# Altium schematic sheet ControlPWMSin.SchDoc
size A4
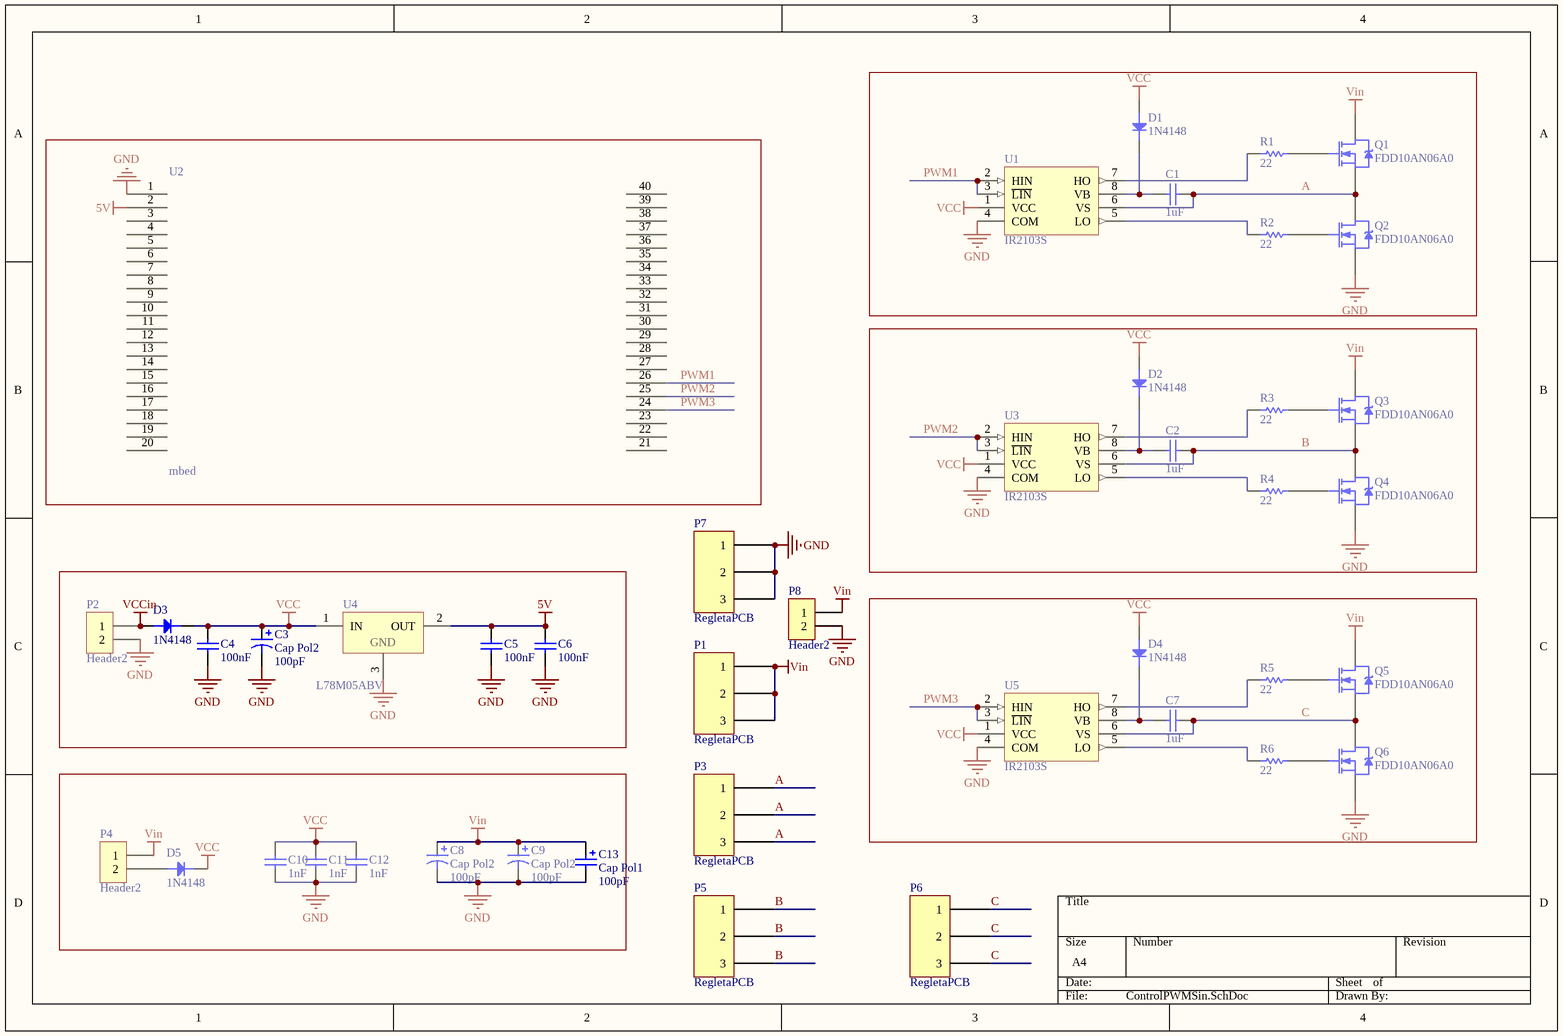
[diagram p0: ControlPWMSin.SchDoc]

## Parts
C1  value 1uF  [0805_CAP]  (hidden comment: Capacitor)
C2  value 1uF  [0805_CAP]  (hidden comment: Capacitor)
C3  Cap Pol2  value 100pF  [TC7360-2924]
C4  value 100nF  [0805_CAP]  (hidden comment: Capacitor)
C5  value 100nF  [0805_CAP]  (hidden comment: Capacitor)
C6  value 100nF  [0805_CAP]  (hidden comment: Capacitor)
C7  value 1uF  [0805_CAP]  (hidden comment: Capacitor)
C8  Cap Pol2  value 100pF  [TC7360-2924]
C9  Cap Pol2  value 100pF  [TC7360-2924]
C10  value 1nF  [0805_CAP]  (hidden comment: Capacitor)
C11  value 1nF  [0805_CAP]  (hidden comment: Capacitor)
C12  value 1nF  [0805_CAP]  (hidden comment: Capacitor)
C13  Cap Pol1  value 100pF  [RB7.6-15]
D1  1N4148  [1N4148SMD]
D2  1N4148  [1N4148SMD]
D3  1N4148  [1N4148SMD]
D4  1N4148  [1N4148SMD]
D5  1N4148  [1N4148SMD]
P1  RegletaPCB  [RegletaPCBx3]
P2  Header2  [Header2Macho]
P3  RegletaPCB  [RegletaPCBx3]
P4  Header2  [Header2Macho]
P5  RegletaPCB  [RegletaPCBx3]
P6  RegletaPCB  [RegletaPCBx3]
P7  RegletaPCB  [RegletaPCBx3]
P8  Header2  [Header2Macho]
Q1  FDD10AN06A0  [TO252-3N]
Q2  FDD10AN06A0  [TO252-3N]
Q3  FDD10AN06A0  [TO252-3N]
Q4  FDD10AN06A0  [TO252-3N]
Q5  FDD10AN06A0  [TO252-3N]
Q6  FDD10AN06A0  [TO252-3N]
R1  value 22  [0805_RES]  (hidden comment: Resistor)
R2  value 22  [0805_RES]  (hidden comment: Resistor)
R3  value 22  [0805_RES]  (hidden comment: Resistor)
R4  value 22  [0805_RES]  (hidden comment: Resistor)
R5  value 22  [0805_RES]  (hidden comment: Resistor)
R6  value 22  [0805_RES]  (hidden comment: Resistor)
U1  IR2103S  [SOIC127P600-8BN]
U2  mbed  [mbed]
U3  IR2103S  [SOIC127P600-8BN]
U4  L78M05ABV  [TO220V]
U5  IR2103S  [SOIC127P600-8BN]

## Nets
5V: C5.1 C6.1 U2.2 U4.2(OUT)
GND: C3.2 C4.2 C5.2 C6.2 C8.2 C9.2 C10.1 C11.1 C12.1 C13.2 P2.2 P7.1 P7.2 P7.3 P8.2 Q2.3(S) Q4.3(S) Q6.3(S) U1.4(COM) U2.1 U3.4(COM) U4.3(GND) U5.4(COM)
VCC: C3.1 C4.1 C10.2 C11.2 C12.2 D1.1(A) D2.1(A) D3.2(K) D4.1(A) D5.2(K) U1.1(VCC) U3.1(VCC) U4.1(IN) U5.1(VCC)
VCCin: D3.1(A) P2.1
Vin: C8.1 C9.1 C13.1 P1.1 P1.2 P1.3 P4.1 P8.1 Q1.4(D) Q3.4(D) Q5.4(D)
A: C1.1 P3.1 P3.2 P3.3 Q1.3(S) Q2.4(D) U1.6(VS)
B: C2.1 P5.1 P5.2 P5.3 Q3.3(S) Q4.4(D) U3.6(VS)
C: C7.1 P6.1 P6.2 P6.3 Q5.3(S) Q6.4(D) U5.6(VS)
PWM1: U1.2(HIN) U1.3(~{LIN}) U2.26
PWM2: U2.25 U3.2(HIN) U3.3(~{LIN})
PWM3: U2.24 U5.2(HIN) U5.3(~{LIN})
NetC1_2: C1.2 D1.2(K) U1.8(VB)
NetC2_2: C2.2 D2.2(K) U3.8(VB)
NetC7_2: C7.2 D4.2(K) U5.8(VB)
NetD5_1: D5.1(A) P4.2
NetQ1_1: Q1.1(G) R1.2
NetQ2_1: Q2.1(G) R2.2
NetQ3_1: Q3.1(G) R3.2
NetQ4_1: Q4.1(G) R4.2
NetQ5_1: Q5.1(G) R5.2
NetQ6_1: Q6.1(G) R6.2
NetR1_1: R1.1 U1.7(HO)
NetR2_1: R2.1 U1.5(LO)
NetR3_1: R3.1 U3.7(HO)
NetR4_1: R4.1 U3.5(LO)
NetR5_1: R5.1 U5.7(HO)
NetR6_1: R6.1 U5.5(LO)

Not connected (* = marked no-connect by the designer): U2 3 4 5 6 7 8 9 10 11 12 13 14 15 16 17 18 19 20 21 22 23 27 28 29 30 31 32 33 34 35 36 37 38 39 40

## Library data of the parts
C1 C2 C4-C7 C10-C12 = Cap
C3 C8 C9 = Cap Pol2: Polarized Capacitor (Axial); Published: 8-Jun-2000; LatestRevisionDate: 17-Jul-2002; LatestRevisionNote: Re-released for DXP Platform.; PackageReference: POLAR0.8; Publisher: Altium Limited
C13 = Cap Pol1: Polarized Capacitor (Radial); Published: 8-Jun-2000; LatestRevisionDate: 17-Jul-2002; LatestRevisionNote: Re-released for DXP Platform.; PackageReference: RB7.6-15; Publisher: Altium Limited
P1 P3 P5-P7 = RegletaPCBx3
Q1-Q6 = FDD10AN06A0: N-Channel Power MOSFET; Note: Pin 2 is electrically connected to pin 4.; Published: 8-Jun-2000; LatestRevisionDate: 17-Jul-2002; LatestRevisionNote: Re-released for DXP Platform.; DatasheetVersion: PD-9.814; PackageReference: TO-220AB; Publisher: Altium Limited; Code_JEDEC: TO-220-AB; ComponentLink1Description: Manufacturer Link; ComponentLink1URL: http://www.irf.com/
R1-R6 = Res
U1 U3 U5 = IR2103S: High and Low Side Driver; Published: 8-Jun-2000; LatestRevisionDate: 13-Apr-2006; LatestRevisionNote: IPC-7351 Footprint Added.; DatasheetVersion: PD600451; PackageVersion: Feb-2001; PackageReference: SO-8; Publisher: Altium Limited; PackageDescription: 8-Pin Plastic Small Outline Integrated Circuit 1.27 mm Pitch; Code_JEDEC: MS-012-AA; Code_IPC: SOIC127P600-8; ComponentLink1Description: Manufacturer Link; ComponentLink1URL: http://www.irf.com/; ComponentLink2Description: Datasheet; ComponentLink2URL: http://www.irf.com/product-info/datasheets/data/ir2103.pdf
U4 = L78M05ABV: Precision 500mA Regulator; Note: Tab is connected to pin 3 (GND).; Published: 24-Aug-2001; LatestRevisionDate: 17-Jul-2002; LatestRevisionNote: Re-released for DXP Platform.; DatasheetVersion: Mar-1997; PackageReference: TO220V; Publisher: Altium Limited; PackageDescription: TO, Thru-Hole, Vertical, Heatsink Mounted; 3 In-Line Leads; Pitch 2.54 mm; Pin sequence 1, 3, 2; ComponentLink1Description: Manufacturer Link; ComponentLink1URL: http://www.st.com/; ComponentLink2Description: Datasheet; ComponentLink2URL: http://www.st.com/stonline/products/literature/ds/2147/l78m05ab.pdf